# EAGLE design seq s-h 1-13-21-fix (EAGLE 9.6.2)
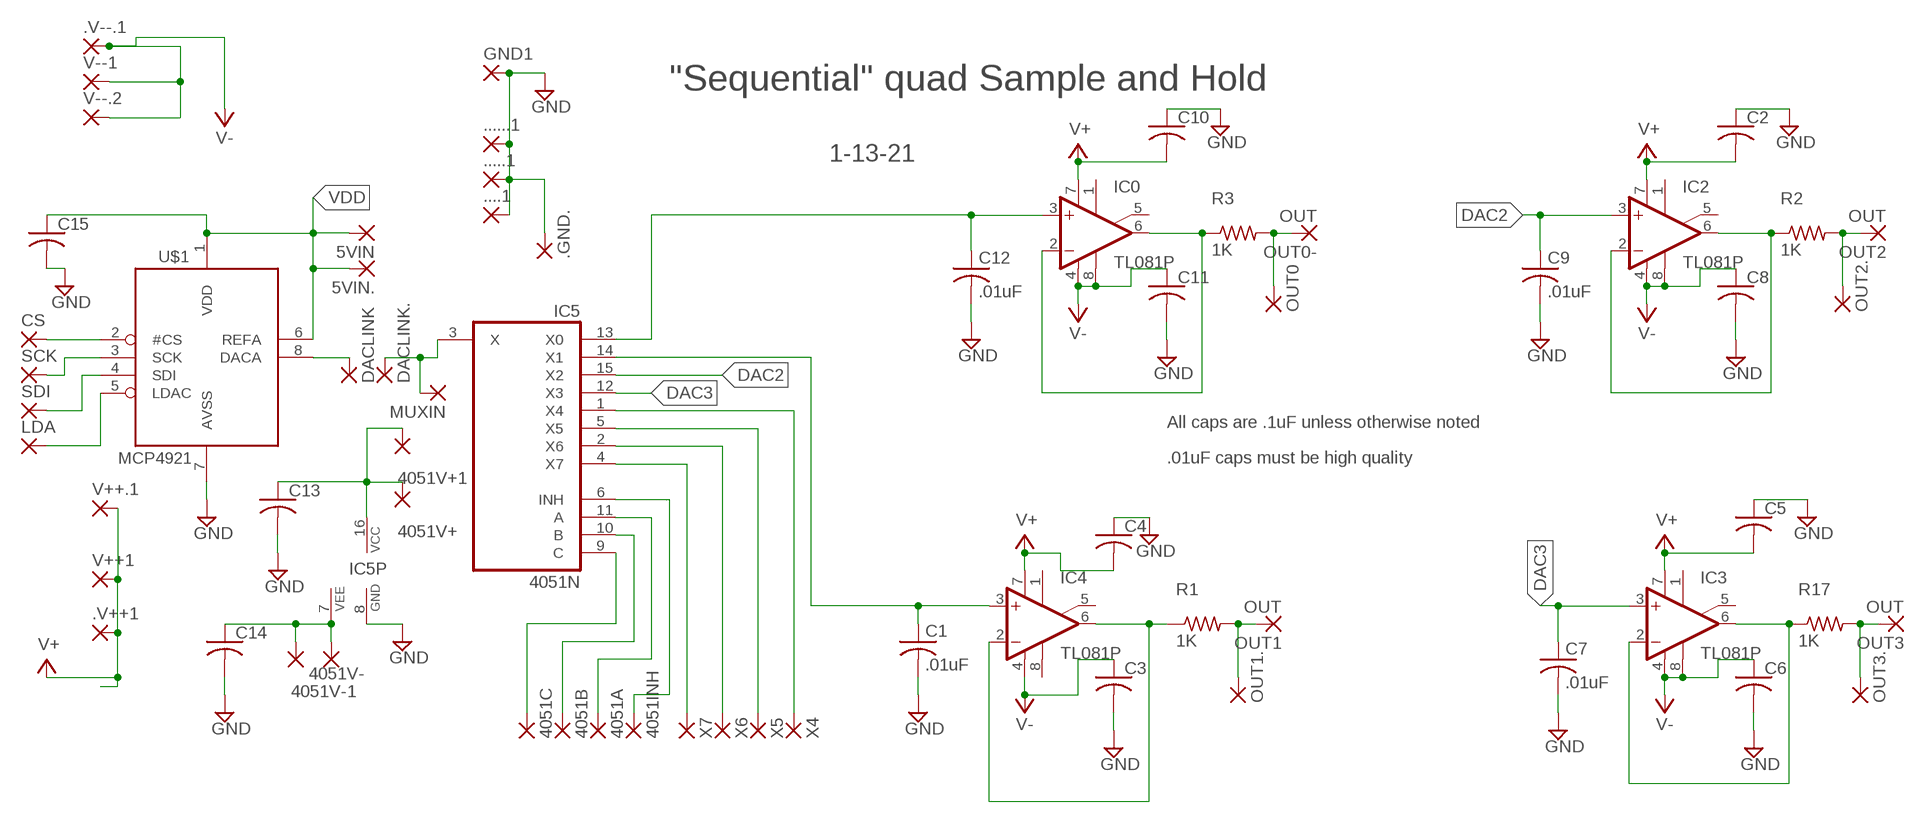
[diagram p0: schematic, sheet 1]

## Parts
5VIN  WIREPAD3,17/1,3  [3,17/1,3@1]
5VIN.  WIREPAD1,6/0,9  [1,6/0,9]
4051A  WIREPAD1,6/0,9  [1,6/0,9]
4051B  WIREPAD1,6/0,9  [1,6/0,9]
4051C  WIREPAD1,6/0,9  [1,6/0,9]
4051INH  WIREPAD1,6/0,9  [1,6/0,9]
4051V+  3,17/1,3  [3,17/1,3]
4051V+1  WIREPAD1,6/0,9  [1,6/0,9]
4051V-  3,17/1,3  [3,17/1,3]
4051V-1  WIREPAD1,6/0,9  [1,6/0,9]
....1  3,17/1,3  [3,17/1,3]
.....1  3,17/1,3  [3,17/1,3]
......1  3,17/1,3  [3,17/1,3]
.GND.  WIREPAD1,6/0,9  [1,6/0,9]
.V++1  2,54/1,0  [2,54/1,0]
.V--.1  3,17/1,3  [3,17/1,3]
C1  .01uF  C-US050-025X075  [C050-025X075]
C2  C-US025-024X044  [C025-024X044]
C3  C-US025-024X044  [C025-024X044]
C4  C-US025-024X044  [C025-024X044]
C5  C-US025-024X044  [C025-024X044]
C6  C-US025-024X044  [C025-024X044]
C7  .01uF  C-US050-025X075  [C050-025X075]
C8  C-US025-024X044  [C025-024X044]
C9  .01uF  C-US050-025X075  [C050-025X075]
C10  C-US025-024X044  [C025-024X044]
C11  C-US025-024X044  [C025-024X044]
C12  .01uF  C-US050-025X075  [C050-025X075]
C13  C-US025-024X044  [C025-024X044]
C14  C-US025-024X044  [C025-024X044]
C15  C-US025-024X044  [C025-024X044]
CS  WIREPAD1,6/0,9  [1,6/0,9]
DACLINK  WIREPAD1,6/0,9  [1,6/0,9]
DACLINK.  WIREPAD1,6/0,9  [1,6/0,9]
GND1  3,17/1,3  [3,17/1,3]
IC0  TL081P  [DIL08]
IC2  TL081P  [DIL08]
IC3  TL081P  [DIL08]
IC4  TL081P  [DIL08]
IC5  4051N  [DIL16]
LDA  WIREPAD1,6/0,9  [1,6/0,9]
MUXIN  3,17/1,3  [3,17/1,3]
OUT0  WIREPAD1,6/0,9  [1,6/0,9]
OUT0-  OUT  3,17/1,3  [3,17/1,3]
OUT1  OUT  3,17/1,3  [3,17/1,3]
OUT1.  WIREPAD1,6/0,9  [1,6/0,9]
OUT2  OUT  3,17/1,3  [3,17/1,3]
OUT2.  WIREPAD1,6/0,9  [1,6/0,9]
OUT3  OUT  3,17/1,3  [3,17/1,3]
OUT3.  WIREPAD1,6/0,9  [1,6/0,9]
R1  1K  R-US_0204/7  [0204/7]
R2  1K  R-US_0204/7  [0204/7]
R3  1K  R-US_0204/7  [0204/7]
R17  1K  R-US_0204/7  [0204/7]
SCK  WIREPAD1,6/0,9  [1,6/0,9]
SDI  WIREPAD1,6/0,9  [1,6/0,9]
U$1  MCP4921  [DIL08]
V++1  2,54/1,0  [2,54/1,0]
V++.1  2,54/1,0  [2,54/1,0]
V--1  3,17/1,3  [3,17/1,3]
V--.2  3,17/1,3  [3,17/1,3]
X4  WIREPAD1,6/0,9  [1,6/0,9]
X5  WIREPAD1,6/0,9  [1,6/0,9]
X6  WIREPAD1,6/0,9  [1,6/0,9]
X7  WIREPAD1,6/0,9  [1,6/0,9]

## Nets
DAC2: C9.1 IC2.3(+IN) IC5.15(X2)
DAC3: C7.1 IC3.3(+IN) IC5.12(X3)
GND: ....1.1(P) .....1.1(P) ......1.1(P) .GND..1(P) C1.2 C2.1 C3.2 C4.1 C5.1 C6.2 C7.2 C8.2 C9.2 C10.1 C11.2 C12.2 C13.2 C14.2 C15.2 GND1.1(P) IC5.8(GND) U$1.7(AVSS)
N$1: OUT1.1(P) OUT1..1(P) R1.2
N$2: DACLINK..1(P) IC5.3(X) MUXIN.1(P)
N$3: C1.1 IC4.3(+IN) IC5.14(X1)
N$4: OUT2.1(P) OUT2..1(P) R2.2
N$5: IC4.2(-IN) IC4.6(OUT) R1.1
N$6: IC2.2(-IN) IC2.6(OUT) R2.1
N$7: CS.1(P) U$1.2(#CS)
N$8: OUT0-.1(P) OUT0.1(P) R3.2
N$9: IC0.2(-IN) IC0.6(OUT) R3.1
N$10: C12.1 IC0.3(+IN) IC5.13(X0)
N$11: SCK.1(P) U$1.3(SCK)
N$12: SDI.1(P) U$1.4(SDI)
N$13: LDA.1(P) U$1.5(LDAC)
N$14: 4051C.1(P) IC5.9(C)
N$15: 4051B.1(P) IC5.10(B)
N$16: 4051A.1(P) IC5.11(A)
N$17: 4051INH.1(P) IC5.6(INH)
N$18: IC3.2(-IN) IC3.6(OUT) R17.1
N$19: OUT3.1(P) OUT3..1(P) R17.2
N$20: IC5.4(X7) X7.1(P)
N$21: IC5.2(X6) X6.1(P)
N$22: IC5.5(X5) X5.1(P)
N$23: IC5.1(X4) X4.1(P)
N$24: 4051V+1.1(P) 4051V+.1(P) C13.1 IC5.16(VCC)
N$25: 4051V-1.1(P) 4051V-.1(P) C14.1 IC5.7(VEE)
N$26: DACLINK.1(P) U$1.8(DACA)
V+: .V++1.1(P) C2.2 C4.2 C5.2 C10.2 IC0.7(V+) IC2.7(V+) IC3.7(V+) IC4.7(V+) V++1.1(P) V++.1.1(P)
V-: .V--.1.1(P) C3.1 C6.1 C8.1 C11.1 IC0.4(V-) IC0.8(OPT) IC2.4(V-) IC2.8(OPT) IC3.4(V-) IC3.8(OPT) IC4.4(V-) V--1.1(P) V--.2.1(P)
VDD: 5VIN.1(P) 5VIN..1(P) C15.1 U$1.1(VDD) U$1.6(REFA)
Unconnected: IC0.1(ON1) IC0.5(ON2) IC2.1(ON1) IC2.5(ON2) IC3.1(ON1) IC3.5(ON2) IC4.1(ON1) IC4.5(ON2) IC4.8(OPT)

## Notes on the sheet
- "Sequential" quad Sample and Hold
- 1-13-21
- All caps are .1uF unless otherwise noted
- .01uF caps must be high quality

## Library data of the parts
5VIN 5VIN. 4051A 4051B 4051C 4051INH 4051V+1 4051V-1 .GND. CS DACLINK DACLINK. LDA OUT0 OUT1. OUT2. OUT3. SCK SDI X4-X7 = wirepad:WIREPAD: Wire PAD connect wire on PCB
4051V+ 4051V- ....1 .....1 ......1 GND1 MUXIN OUT0- OUT1-OUT3 = wirepad:3,17/1,3: THROUGH-HOLE PAD
.V++1 V++1 V++.1 = wirepad-NONAMES:2,54/1,0: THROUGH-HOLE PAD
.V--.1 V--1 V--.2 = wirepad-NONAMES:3,17/1,3: THROUGH-HOLE PAD
C1-C15 = rcl:C-US: CAPACITOR, American symbol; SPICEPREFIX: C
IC0 IC2-IC4 = linear:TL081: OP AMP
IC5 = 40xx:4051: 8-channel ANALOG MULTIPLEXER
R1-R3 R17 = rcl:R-US_: RESISTOR, American symbol
U$1 = adafruit:MCP4921

## Board
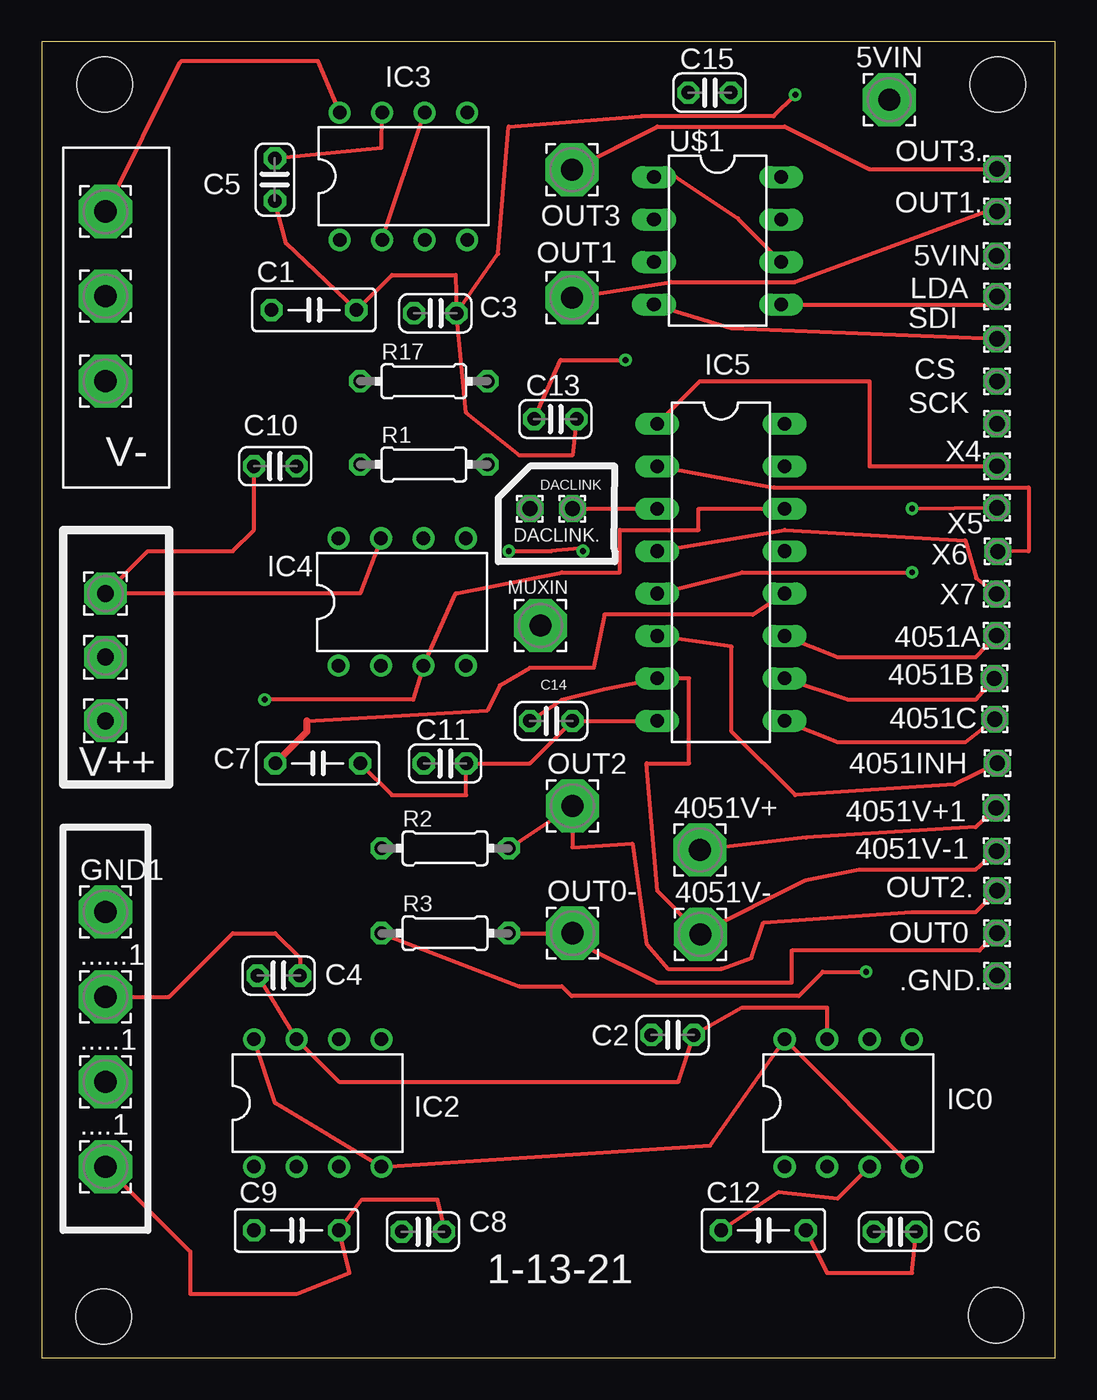
[diagram p1: board, top side]
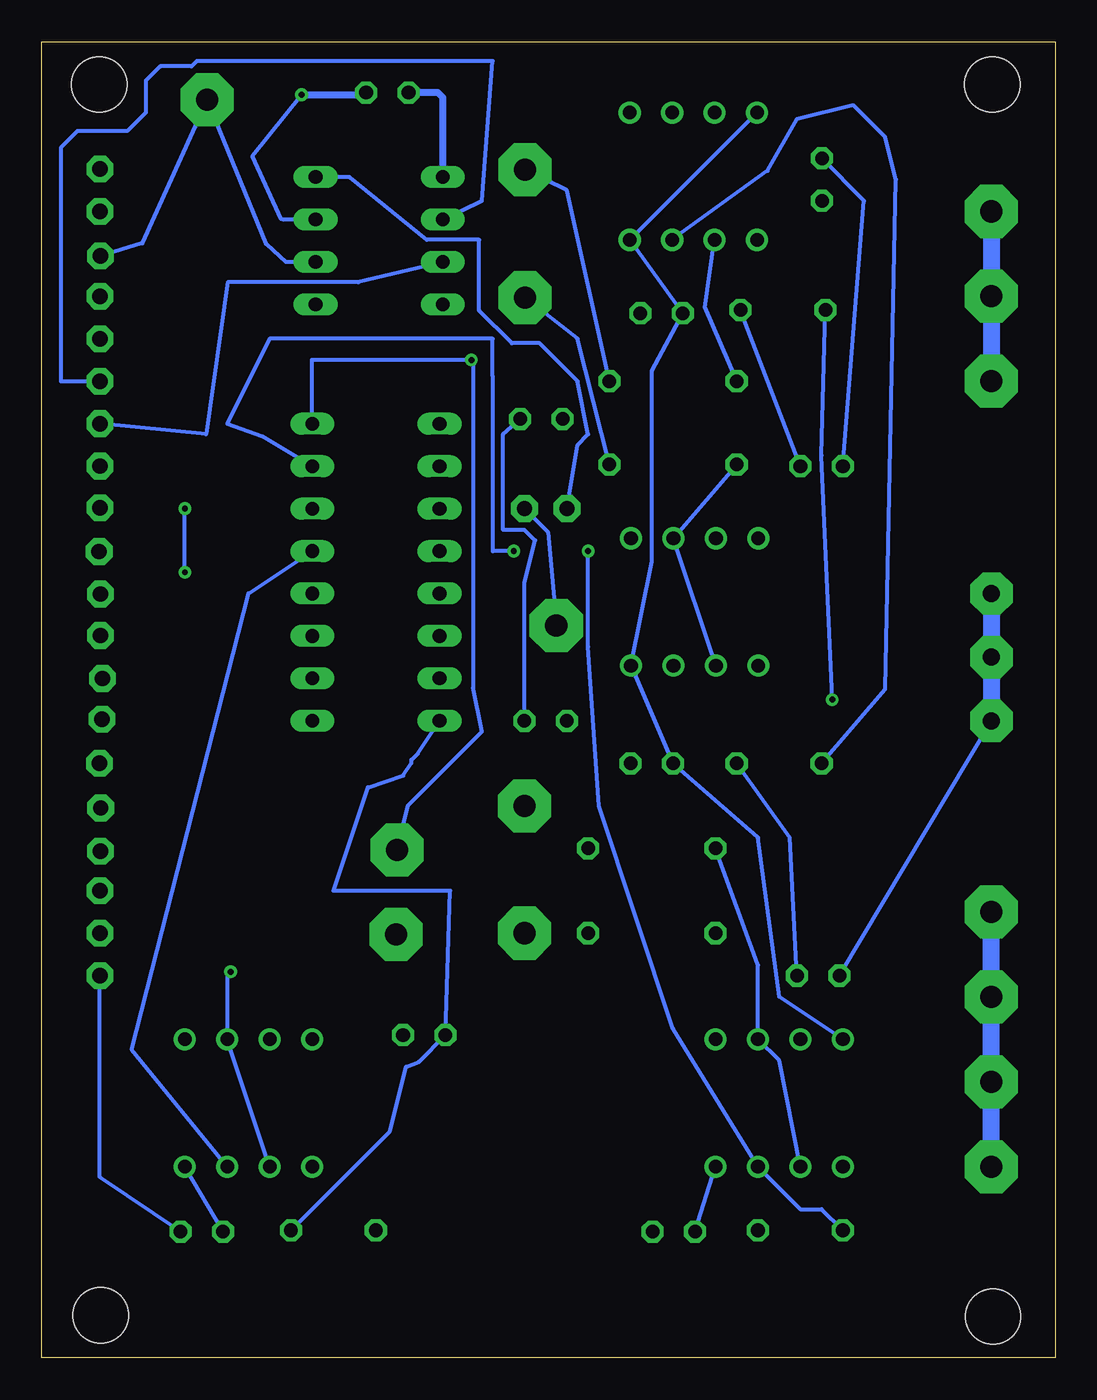
[diagram p2: board, bottom side, seen from below]

Size 60.63 x 78.73 mm. Coordinates in mm from the lower left corner, seen from the top.
Outline: 0,0 60.63,0 60.63,78.73 0,78.73 0,0
Copper layers (1*16): Top 0.035mm / dielectric 1.5mm / Bottom 0.035mm
Design rules "default": minimum track width 6mil, minimum drill 0.35mm, track to track 6mil, track to pad 6mil, pad to pad 6mil, via to via 6mil, smd to smd 6mil, copper to edge 40mil, drill to drill 6mil, minimum pad ring 10mil, minimum via ring 8mil, stop-mask expansion 4mil, vias tented up to drill 0mil, thermal gap 10mil
Holes 3.3 mm at 3.76,76.17 57.2,76.17 57.1,2.54 3.71,2.46

### Footprints (pad centres in the part's own frame; a part is rotated, then mirrored left to right if it is on the bottom)
3,17/1,3@1 = drill 1.321 pad 3.175 octagon: 1 0,0
1,6/0,9 = drill 0.914 pad 1.6 octagon: 1 0,0
3,17/1,3 = drill 1.321 pad 3.175 octagon: 1 0,0
2,54/1,0 = drill 1.016 pad 2.54 octagon: 1 0,0
C050-025X075 = drill 0.813 octagon: 1 -2.54,0; 2 2.54,0
C025-024X044 = drill 0.813 octagon: 1 -1.27,0; 2 1.27,0
DIL08 = drill 0.813 pad 1.27: 1 -3.81,-3.81; 2 -1.27,-3.81; 3 1.27,-3.81; 4 3.81,-3.81; 5 3.81,3.81; 6 1.27,3.81; 7 -1.27,3.81; 8 -3.81,3.81
DIL16 = drill 0.813 long: 1 -8.89,-3.81; 2 -6.35,-3.81; 3 -3.81,-3.81; 4 -1.27,-3.81; 5 1.27,-3.81; 6 3.81,-3.81; 7 6.35,-3.81; 8 8.89,-3.81; 9 8.89,3.81; 10 6.35,3.81; 11 3.81,3.81; 12 1.27,3.81; 13 -1.27,3.81; 14 -3.81,3.81; 15 -6.35,3.81; 16 -8.89,3.81
0204/7 = drill 0.813 octagon: 1 -3.81,0; 2 3.81,0
DIL08' = drill 0.813 long: 1 -3.81,-3.81; 2 -1.27,-3.81; 3 1.27,-3.81; 4 3.81,-3.81; 5 3.81,3.81; 6 1.27,3.81; 7 -1.27,3.81; 8 -3.81,3.81

### Placement (x,y rotation side)
5VIN  50.72,75.26 0 top
5VIN.  57.12,65.91 0 top
4051A  57.12,43.21 0 top
4051B  57,40.64 0 top
4051C  57.02,38.2 0 top
4051INH  57.18,35.56 0 top
4051V+  39.37,30.38 0 top
4051V+1  57.1,32.89 0 top
4051V-  39.42,25.32 0 top
4051V-1  57.12,30.3 0 top
....1  3.81,11.43 0 top
.....1  3.81,16.51 0 top
......1  3.81,21.59 0 top
.GND.  57.15,22.86 0 top
.V++1  3.81,41.91 0 top
.V--.1  3.81,58.42 0 top
C1  16.28,62.69 0 top
C2  37.74,19.3 0 top
C3  23.55,62.48 0 top
C4  14.17,22.86 180 top
C5  13.94,70.48 90 top
C6  51.05,7.54 0 top
C7  16.51,35.56 0 top
C8  22.81,7.54 0 top
C9  15.24,7.62 0 top
C10  13.97,53.34 180 top
C11  24.13,35.56 0 top
C12  43.18,7.62 0 top
C13  30.73,56.16 0 top
C14  30.48,38.1 0 top
C15  39.95,75.69 0 top
CS  57.15,58.42 0 top
DACLINK  29.21,50.8 0 top
DACLINK.  31.75,50.8 0 top
GND1  3.81,26.67 0 top
IC0  48.26,15.24 0 top
IC2  16.51,15.24 0 top
IC3  21.64,70.69 0 top
IC4  21.56,45.21 0 top
IC5  40.64,46.99 270 top
LDA  57.15,63.5 0 top
MUXIN  29.84,43.81 0 top
OUT0  57.15,25.4 0 top
OUT0-  31.75,25.4 0 top
OUT1  31.72,63.42 0 top
OUT1.  57.15,68.58 0 top
OUT2  31.75,33.02 0 top
OUT2.  57.15,27.94 0 top
OUT3  31.72,71.07 0 top
OUT3.  57.15,71.12 0 top
R1  22.86,53.44 0 top
R2  24.13,30.48 0 top
R3  24.13,25.4 0 top
R17  22.86,58.42 0 top
SCK  57.15,55.88 0 top
SDI  57.15,60.96 0 top
U$1  MCP4921  [DIL08']  40.44,66.83 270 top
V++1  3.81,45.72 0 top
V++.1  3.81,38.1 0 top
V--1  3.81,63.5 0 top
V--.2  3.81,68.58 0 top
X4  57.15,53.34 0 top
X5  57.15,50.85 0 top
X6  57.2,48.23 0 top
X7  57.12,45.69 0 top

### Tracks (layer width: path | path; a pad name or v marks a point on that pad's centre or on a via)
DAC2  (via drill 0.35)
  Top 0.254: v32.38,48.26 32.14,48.43 30.48,48.26 v27.94,48.26
  Bottom 0.254: C9.1 13.97,8.89 15.24,8.89 IC2.3 22.86,19.69 27.3,33.02 27.94,42.55 v27.94,48.26 | IC5.15 47.44,55.13 49.53,55.88 46.99,60.96 33.66,60.96 33.66,58.72 33.63,58.69 33.63,48.26 v32.38,48.26
DAC3
  Top 0.254: 15.88,38.1 26.67,38.73 27.42,40.23 29.21,41.27 33.02,41.27 33.66,44.45 42.55,44.45 IC5.12
  Top 0.406: C7.1 15.88,37.46 15.88,38.1
  Bottom 0.254: C7.1 10.16,40 9.52,70.48 10.16,73.03 12.07,74.93 15.45,74.08 17.21,71.01 IC3.3
GND  (via drill 0.35)
  Top 0.254: ......1.1 7.62,21.59 11.43,25.4 13.97,25.4 15.44,23.93 C4.1 | ....1.1 8.89,6.35 8.89,3.81 15.24,3.81 18.41,5.08 C9.2 19.17,9.47 23.66,9.47 24.13,7.49 C8.2 | C12.2 46.99,5.08 52.07,5.08 C6.2 | C7.2 20.95,33.66 25.4,33.66 C11.2 29.21,35.56 C14.2 IC5.8 | C3.2 24.77,64.77 20.95,64.77 C1.2 14.61,66.67 C5.1 | C13.2 31.75,53.97 28.58,53.97 25.4,56.52 C3.2 | C3.2 27.3,66.04 27.94,73.66 35.87,74.27 43.79,74.27 v45.09,75.56
  Bottom 0.254: C4.1 15.88,31.11 C7.2 | C12.2 39.79,13.55 38.83,17.41 38.07,17.71 C2.1 36.2,27.94 43.18,27.94 41.12,34.13 39.01,34.83 38.52,35.57 38.51,35.61 38.51,35.77 38.14,36.13 IC5.8 | C10.1 C1.2 | C13.2 33.02,55.24 33.02,49.53 31.75,49.53 31.12,48.89 31.75,46.35 C14.2 | v45.09,75.56 48.03,71.88 46.34,68.16 46.13,68.1 U$1.7 | C6.2 57.15,10.8 .GND..1
  Bottom 0.406: v45.09,75.56 41.35,75.56 C15.2
  Bottom 1.016: ....1.1 .....1.1 ......1.1 GND1.1
N$1
  Top 0.254: OUT1.1 37.63,64.36 45.09,64.36 56.53,68.58 OUT1..1
  Bottom 0.254: R1.2 28.58,60.96 OUT1.1
N$2
  Top 0.254: DACLINK..1 IC5.3
  Bottom 0.254: DACLINK..1 30.35,49.4 MUXIN.1
N$3  (via drill 0.35)
  Top 0.254: v13.34,39.37 22.23,39.37 IC4.3 24.77,45.72 31.12,46.99 34.59,46.99 34.59,49.53 39.29,49.53 39.29,50.8 IC5.14
  Bottom 0.254: v13.34,39.37 13.97,53.97 C1.1
N$4
  Top 0.254: R2.2 OUT2.1 31.75,30.54 35.34,30.76 36.2,24.77 37.47,23.27 40.66,23.27 42.48,23.92 43.18,26.03 52.07,26.67 55.88,26.67 OUT2..1
N$5
  Bottom 0.254: IC4.2 IC4.6 R1.1
N$6
  Bottom 0.254: IC2.2 16.51,17.78 IC2.6 17.78,23.49 R2.1
N$7
  Bottom 0.254: U$1.2 34.29,69.22 33.65,77.57 51.36,77.57 51.66,77.27 53.54,77.27 54.41,76.4 54.41,74.5 55.52,73.38 58.5,73.38 59.49,72.39 59.49,58.42 CS.1
N$8
  Top 0.254: R3.2 OUT0-.1 32.59,24.56 36.8,22.45 44.88,22.45 44.88,24.36 56.11,24.36 OUT0.1
N$9  (via drill 0.35)
  Top 0.254: R3.1 28.58,22.22 31.12,22.22 31.7,21.64 45.29,21.64 46.74,23.09 v49.33,23.09
  Bottom 0.254: IC0.2 IC0.6 49.53,22.88 v49.33,23.09
N$10
  Top 0.254: C12.1 44.09,9.92 47.62,9.52 IC0.3
  Bottom 0.254: IC0.3 55.24,18.41 48.26,45.72 IC5.13
N$11
  Bottom 0.254: U$1.3 41.7,64.34 49.5,64.34 50.8,55.24 SCK.1
N$12
  Top 0.254: U$1.4 41.27,61.59 SDI.1
N$13
  Top 0.254: U$1.5 56.67,63.02 LDA.1
N$14
  Top 0.254: IC5.9 47.62,36.83 55.24,36.83 4051C.1
N$15
  Top 0.254: IC5.10 48.26,39.37 55.88,39.37 4051B.1
N$16
  Top 0.254: IC5.11 47.62,41.91 55.88,41.91 4051A.1
N$17
  Top 0.254: 4051INH.1 54.61,34.29 45.09,33.66 41.27,37.46 41.27,42.55 IC5.6
N$18
  Top 0.254: IC3.2 IC3.6
  Bottom 0.254: R17.1 20.95,62.87 IC3.2
N$19
  Top 0.254: OUT3.1 36.83,73.66 44.45,73.66 49.53,71.12 OUT3..1
  Bottom 0.254: R17.2 29.21,69.85 OUT3.1
N$20
  Top 0.254: IC5.4 44.45,49.53 55.24,48.89 55.9,46.63 57.15,45.72 X7.1
N$21
  Top 0.254: IC5.2 43.81,52.07 59.05,52.07 59.05,48.26 X6.1
N$22  (via drill 0.35)
  Top 0.254: IC5.5 41.91,46.99 v52.07,46.99 | v52.07,50.8 X5.1
  Bottom 0.254: v52.07,46.99 v52.07,50.8
N$23
  Top 0.254: IC5.1 39.37,58.42 49.53,58.42 49.53,53.34 X4.1
N$24  (via drill 0.35)
  Top 0.254: C13.1 31.05,59.69 v34.92,59.69 | 4051V+1.1 55.88,31.75 45.72,31.11 4051V+.1
  Bottom 0.254: 4051V+.1 38.72,33.04 34.29,37.46 34.82,40.13 34.82,59.59 v34.92,59.69 44.46,59.69 44.45,59.67 IC5.16
N$25
  Top 0.254: 4051V-.1 39.36,25.39 | 39.36,25.39 36.83,27.94 36.2,35.56 38.73,35.56 38.73,40.64 IC5.7 33.66,40 31.12,39.37 C14.1 | 39.36,25.39 45.72,28.57 48.9,29.21 55.88,29.21 4051V-1.1
N$26
  Bottom 0.254: DACLINK.1 28.58,54.61 27.94,55.24 28.58,58.42 30.85,60.69 32.5,60.69 34.45,62.65 34.45,66.88 37.59,66.88 42.22,70.64 U$1.8
V+
  Top 0.254: C10.2 12.7,49.53 11.43,48.26 6.35,48.26 V++1.1 19.05,45.72 IC4.7 | IC0.7 46.99,20.95 41.91,20.95 C2.2 38.1,16.51 17.78,16.51 IC2.7 C4.2 | C5.2 20.32,72.39 IC3.7
  Bottom 0.254: C10.2 11.43,69.22 C5.2 | C4.2 V++.1.1
  Bottom 1.016: V++1.1 .V++1.1 V++.1.1
V-
  Top 0.254: IC0.4 IC0.8 40.01,12.7 IC2.4 13.97,15.24 IC2.8 | V--.2.1 8.25,77.47 8.37,77.59 16.51,77.59 IC3.8
  Bottom 0.254: C8.1 IC2.4 | IC0.4 C6.1 | IC3.8 IC3.4 C3.1 24.13,59.06 24.13,47.62 IC4.4 C11.1 17.78,31.11 16.51,21.59 IC2.8
  Bottom 1.016: V--.2.1 V--1.1 .V--.1.1
VDD
  Top 0.254: U$1.6 41.66,68.15 37.92,70.64 U$1.1
  Bottom 0.254: U$1.6 46.02,65.56 47.21,66.65 5VIN.1 54.61,66.67 5VIN..1
  Bottom 0.406: U$1.1 36.63,75.39 36.93,75.69 C15.1

### Text on the board
tNames: V- | V++ | 1-13-21
tValues: sequential quad SH | AudioDiWHY